# EAGLE design tweeq-Stamp_Compass_HMC5883L (EAGLE 7.2.0)
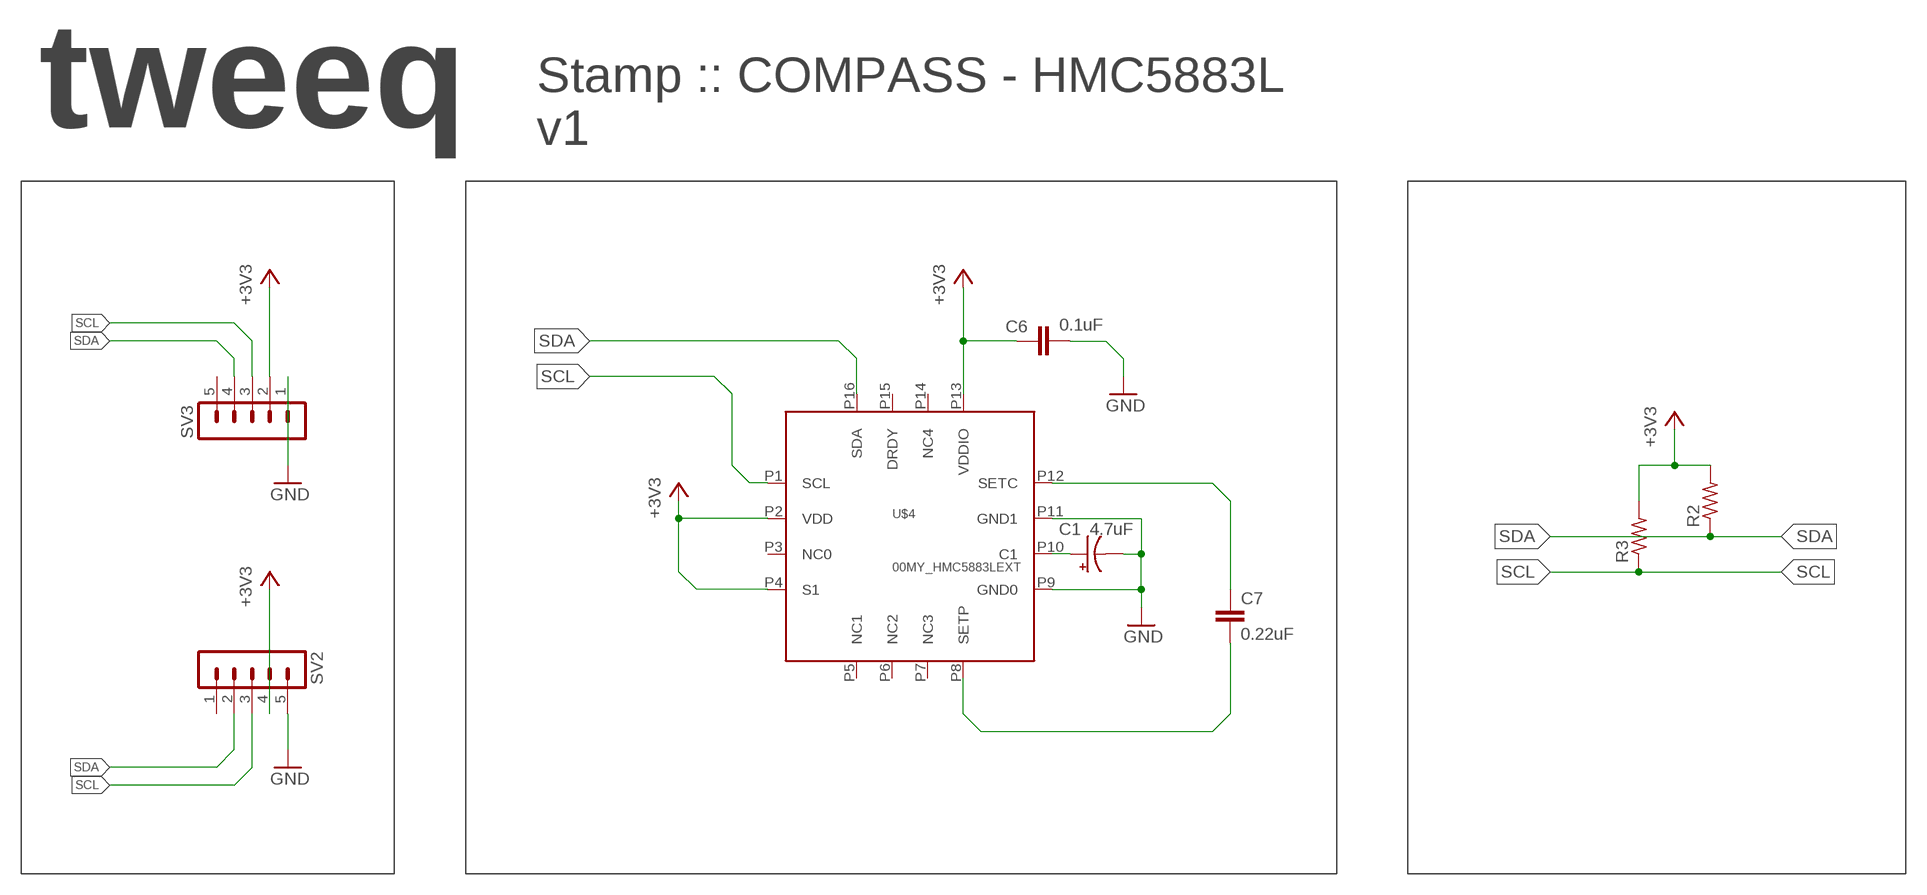
[diagram p0: schematic, sheet 1]

## Parts
C1  4.7uF  CPOL-USSMCA  [SMC_A]
C6  0.1uF  C-EUC0603K  [C0603K]
C7  0.22uF  C-EUC0603K  [C0603K]
R2  R-US_R0402  [R0402]
R3  R-US_R0402  [R0402]
SV2  M05-1STAMP  [1X05-1.5MM-STAMP]
SV3  M05-1STAMP  [1X05-1.5MM-STAMP]
U$4  00MY_HMC5883LEXT  [LPCC16_EXT]

## Nets
+3V3: C6.1 R2.2 R3.2 SV2.4 SV3.2 U$4.P2(VDD) U$4.P4(S1) U$4.P13(VDDIO)
GND: C1.- C6.2 SV2.5 SV3.1 U$4.P9(GND0) U$4.P11(GND1)
N$1: C1.+ U$4.P10(C1)
N$5: C7.1 U$4.P12(SETC)
N$7: C7.2 U$4.P8(SETP)
SCL: R3.1 SV2.3 SV3.3 U$4.P1(SCL)
SDA: R2.1 SV2.2 SV3.4 U$4.P16(SDA)
Unconnected: SV2.1 SV3.5 U$4.P3(NC0) U$4.P5(NC1) U$4.P6(NC2) U$4.P7(NC3) U$4.P14(NC4) U$4.P15(DRDY)

## Notes on the sheet
- tweeq
- Stamp :: COMPASS - HMC5883L
  v1

## Library data of the parts
C1 = AISCube:CPOL-US: POLARIZED CAPACITOR, American symbol
C6 C7 = AISCube:C-EU: CAPACITOR, European symbol
R2 R3 = AISCube:R-US_: RESISTOR, American symbol
SV2 SV3 = AISCube:M05-1: PIN HEADER Standard 0.1" header pin 5 pins - 1 way
U$4 = AISCube:00MY_HMC5883L

## Board
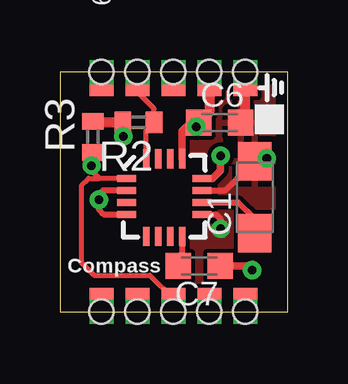
[diagram p1: board, top side]
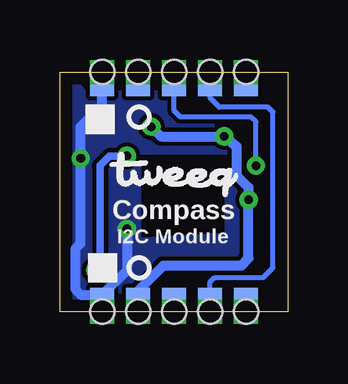
[diagram p2: board, bottom side, seen from below]

Size 9.5 x 10 mm. Coordinates in mm from the lower left corner, seen from the top.
Outline: 9.5,10 0,10 0,0 9.5,0 9.5,10
Copper layers (1*16): Top 0.0356mm / dielectric 1.5011mm / Bottom 0.0356mm
Design rules "AISCube": minimum track width 7mil, minimum drill 14mil, track to track 7mil, track to pad 7mil, pad to pad 7mil, via to via 7mil, smd to smd 0mil, copper to edge 20mil, drill to drill 8mil, minimum pad ring 10mil, minimum via ring 8mil, stop-mask expansion 4mil, vias tented up to drill 32mil, thermal gap 10mil

### Footprints (pad centres in the part's own frame; a part is rotated, then mirrored left to right if it is on the bottom)
SMC_A = smd 1.6 x 1.4: + -1.5,0; - 1.5,0
C0603K = smd 1.05 x 1.08: 1 -0.875,0; 2 0.875,0
R0402 = smd 0.7 x 0.9: 1 -0.65,0; 2 0.65,0
1X05-1.5MM-STAMP = drill 0.5 pad 1 square: 1 -3,0; 2 -1.5,0; 3 0,0; 4 1.5,0; 5 3,0 | smd 1 x 0.6: P$1 -3,0.7; P$2 -1.5,0.7; P$3 0,0.7; P$4 1.5,0.7; P$5 3,0.7 | smd 1 x 0.6 bottom: P$6 -3,0.7; P$7 -1.5,0.7; P$8 0,0.7; P$9 1.5,0.7; P$10 3,0.7 | hole 1: -3,0; -1.5,0; 0,0; 1.5,0; 3,0
LPCC16_EXT = smd 0.8 x 0.28: P1 -1.57,0.75; P2 -1.57,0.25; P3 -1.57,-0.25; P4 -1.57,-0.75; P9 1.57,-0.75; P10 1.57,-0.25; P11 1.57,0.25; P12 1.57,0.75 | smd 0.28 x 0.8: P5 -0.75,-1.67; P6 -0.25,-1.67; P7 0.25,-1.67; P8 0.75,-1.67; P13 0.75,1.57; P14 0.25,1.57; P15 -0.25,1.57; P16 -0.75,1.57

### Placement (x,y rotation side)
C1  8.13,4.78 90 top
C6  6.67,7.89 0 top
C7  5.81,1.92 180 top
R2  3.28,7.9 180 top
R3  1.38,7.29 90 top
SV2  4.74,0 0 top
SV3  4.74,10 180 top
U$1  [TWEEQ-LOGO-S]  7.42,4.78 0 bottom
U$4  4.35,4.81 0 top

### Tracks (layer width: path | path; a pad name or v marks a point on that pad's centre or on a via)
+3V3  (via drill 0.36)  (1 unrouted)
  Top 0.203: 1.65,4.45 v1.63,4.67
  Top 0.254: U$4.P2 1.81,5.06 1.63,4.88 v1.63,4.67 1.63,4.27 1.83,4.06 U$4.P4 | v5.69,7.72 5.69,7.78 C6.1
  Top 0.305: U$4.P13 5.1,7.54 5.28,7.72 v5.69,7.72
  Top 0.406: 2.47,7.89 1.43,7.89 R3.2 | R2.2 2.47,7.89 | 2.47,7.89 v2.64,7.32 | v5.69,7.72 5.96,7.99 | SV3.2 6.24,8.33 C6.1
  Bottom 0.406: v5.69,7.72 5.28,7.32 v2.64,7.32 2.13,6.91 2.13,5.69 1.63,5.18 v1.63,4.67 1.63,2.23 1.93,1.93 5.18,1.93 6.24,0.88 SV2.4
GND  (via drill 0.36)
  Top 0.254: U$4.P9 6.51,4.06 6.71,3.86 v6.71,3.45 | 8.03,5.69 8.03,6.17 | U$4.P11 6.91,5.06 8.03,6.17 | v8.64,6.4 8.51,6.28 C1.- 8.03,6.17
  Top 0.406: C6.2 7.74,8.08 SV3.1
  Bottom 0.406: v6.71,3.45 6.71,1.73 7.74,0.7 | 7.72,0.01 SV2.5 7.74,0.7 | SV3.1 7.74,8.62 8.64,7.72 v8.64,6.4 8.64,2.85 8.84,2.64 8.84,0.91 8.64,0.71 7.92,0.71 7.91,0.7 7.74,0.7
  pour Bottom: 0.19,9.85 9.34,9.85 9.34,0.21 0.19,0.21
  pour Top: 0.19,9.85 9.34,9.85 9.34,0.21 0.19,0.21
N$1
  Top 0.254: U$4.P10 7.43,4.56 8.13,3.86 C1.+
N$3
  cutout Bottom: 6.09,6.55 6.09,3.09 2.64,3.29 2.64,6.55
N$5  (via drill 0.36)
  Top 0.305: U$4.P12 6.37,5.56 6.71,5.89 v6.71,6.5 | C7.1 7.84,1.92 v8.03,1.73
  Bottom 0.305: v6.71,6.5 7.42,6.5 7.82,6.1 7.82,1.93 v8.03,1.73
N$7
  Top 0.254: U$4.P8 5.1,2.08
  Top 0.305: 5.1,2.08 C7.2
N$9
  cutout Top: 2.63,6.6 6.09,6.6 6.09,3.15 2.63,3.15
SCL  (via drill 0.36)
  Top 0.203: U$4.P1 1.65,5.56 | 1.65,5.56 1.32,5.89 v1.32,6.1 1.32,6.49 R3.1 | 1.65,5.56 1.19,5.56 0.91,5.28 0.91,2.03 1.42,1.52 3.76,1.52 4.74,0.55 SV2.3
  Bottom 0.203: v1.32,6.1 1.32,7.92 1.52,8.13 4.47,8.13 4.74,8.39 SV3.3
SDA
  Top 0.203: U$4.P16 3.6,7.57 R2.1 3.93,8.47 3.23,9.16 SV3.4
  Bottom 0.203: SV2.2 3.23,1.24 3.05,1.42 1.02,1.42 0.61,1.83 0.61,8.33 0.81,8.53 2.85,8.53 3.23,8.93 SV3.4

### Text on the board
tPlace: Compass
bPlace: Compass | I2C Module
tNames: 6V-9V DC | ON
bNames: Breadboard | V-Reg | Module